# EasyEDA Pro project ProProject_Stc32f_Car副本_2024-06-03.epro, board PCB6
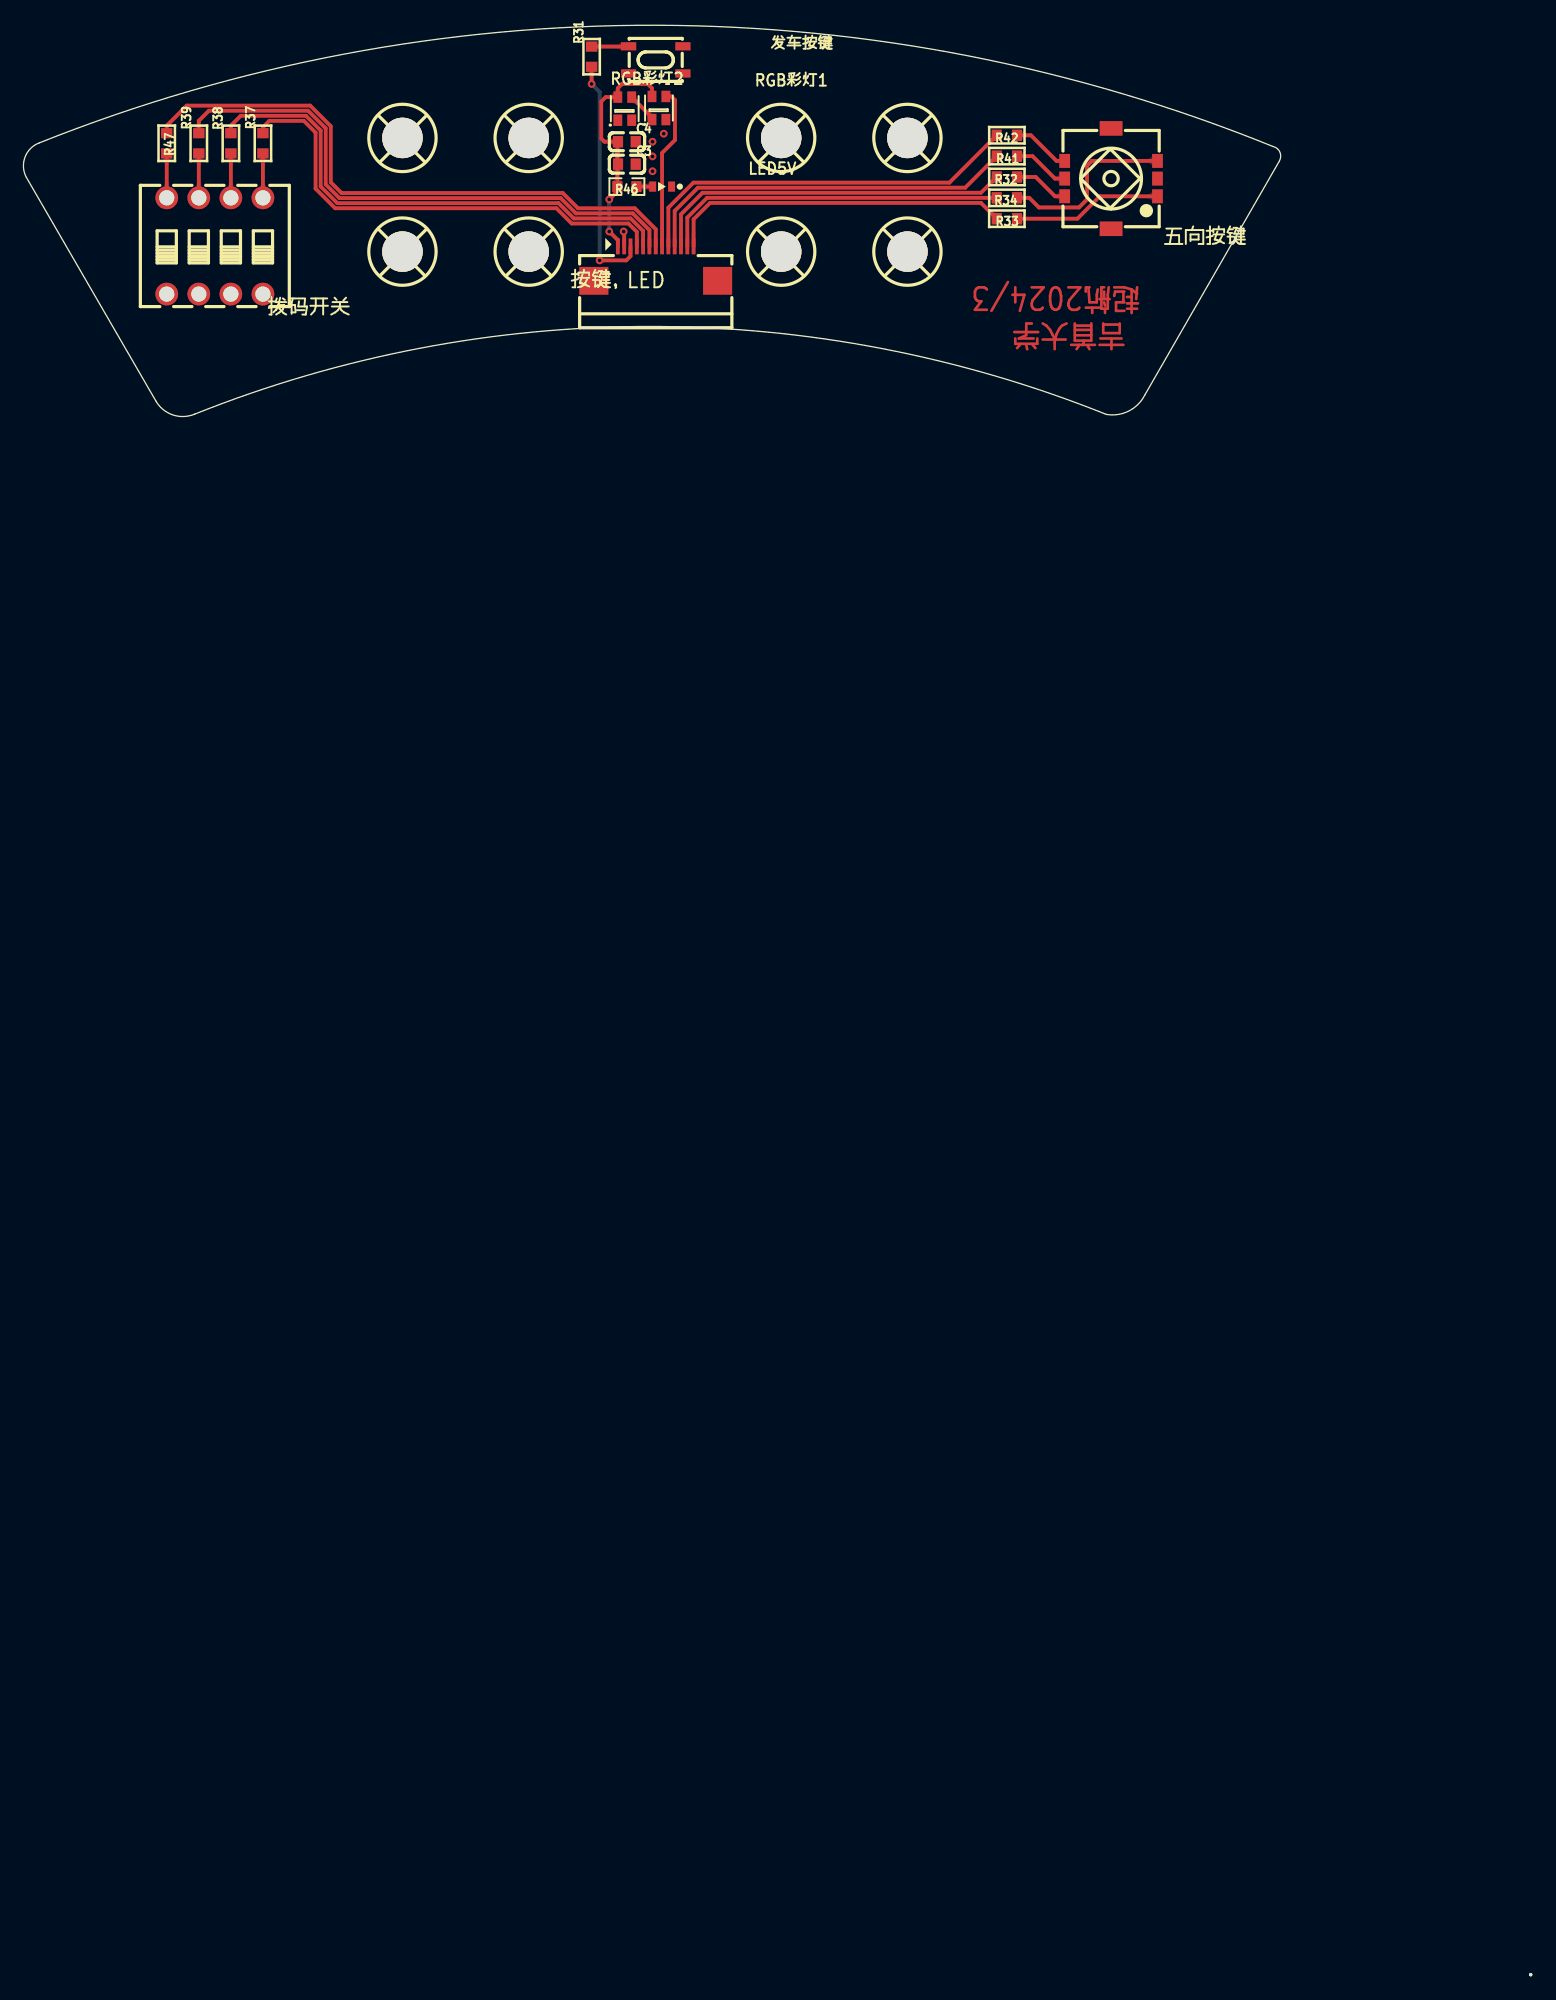
[diagram p11: board, top side]
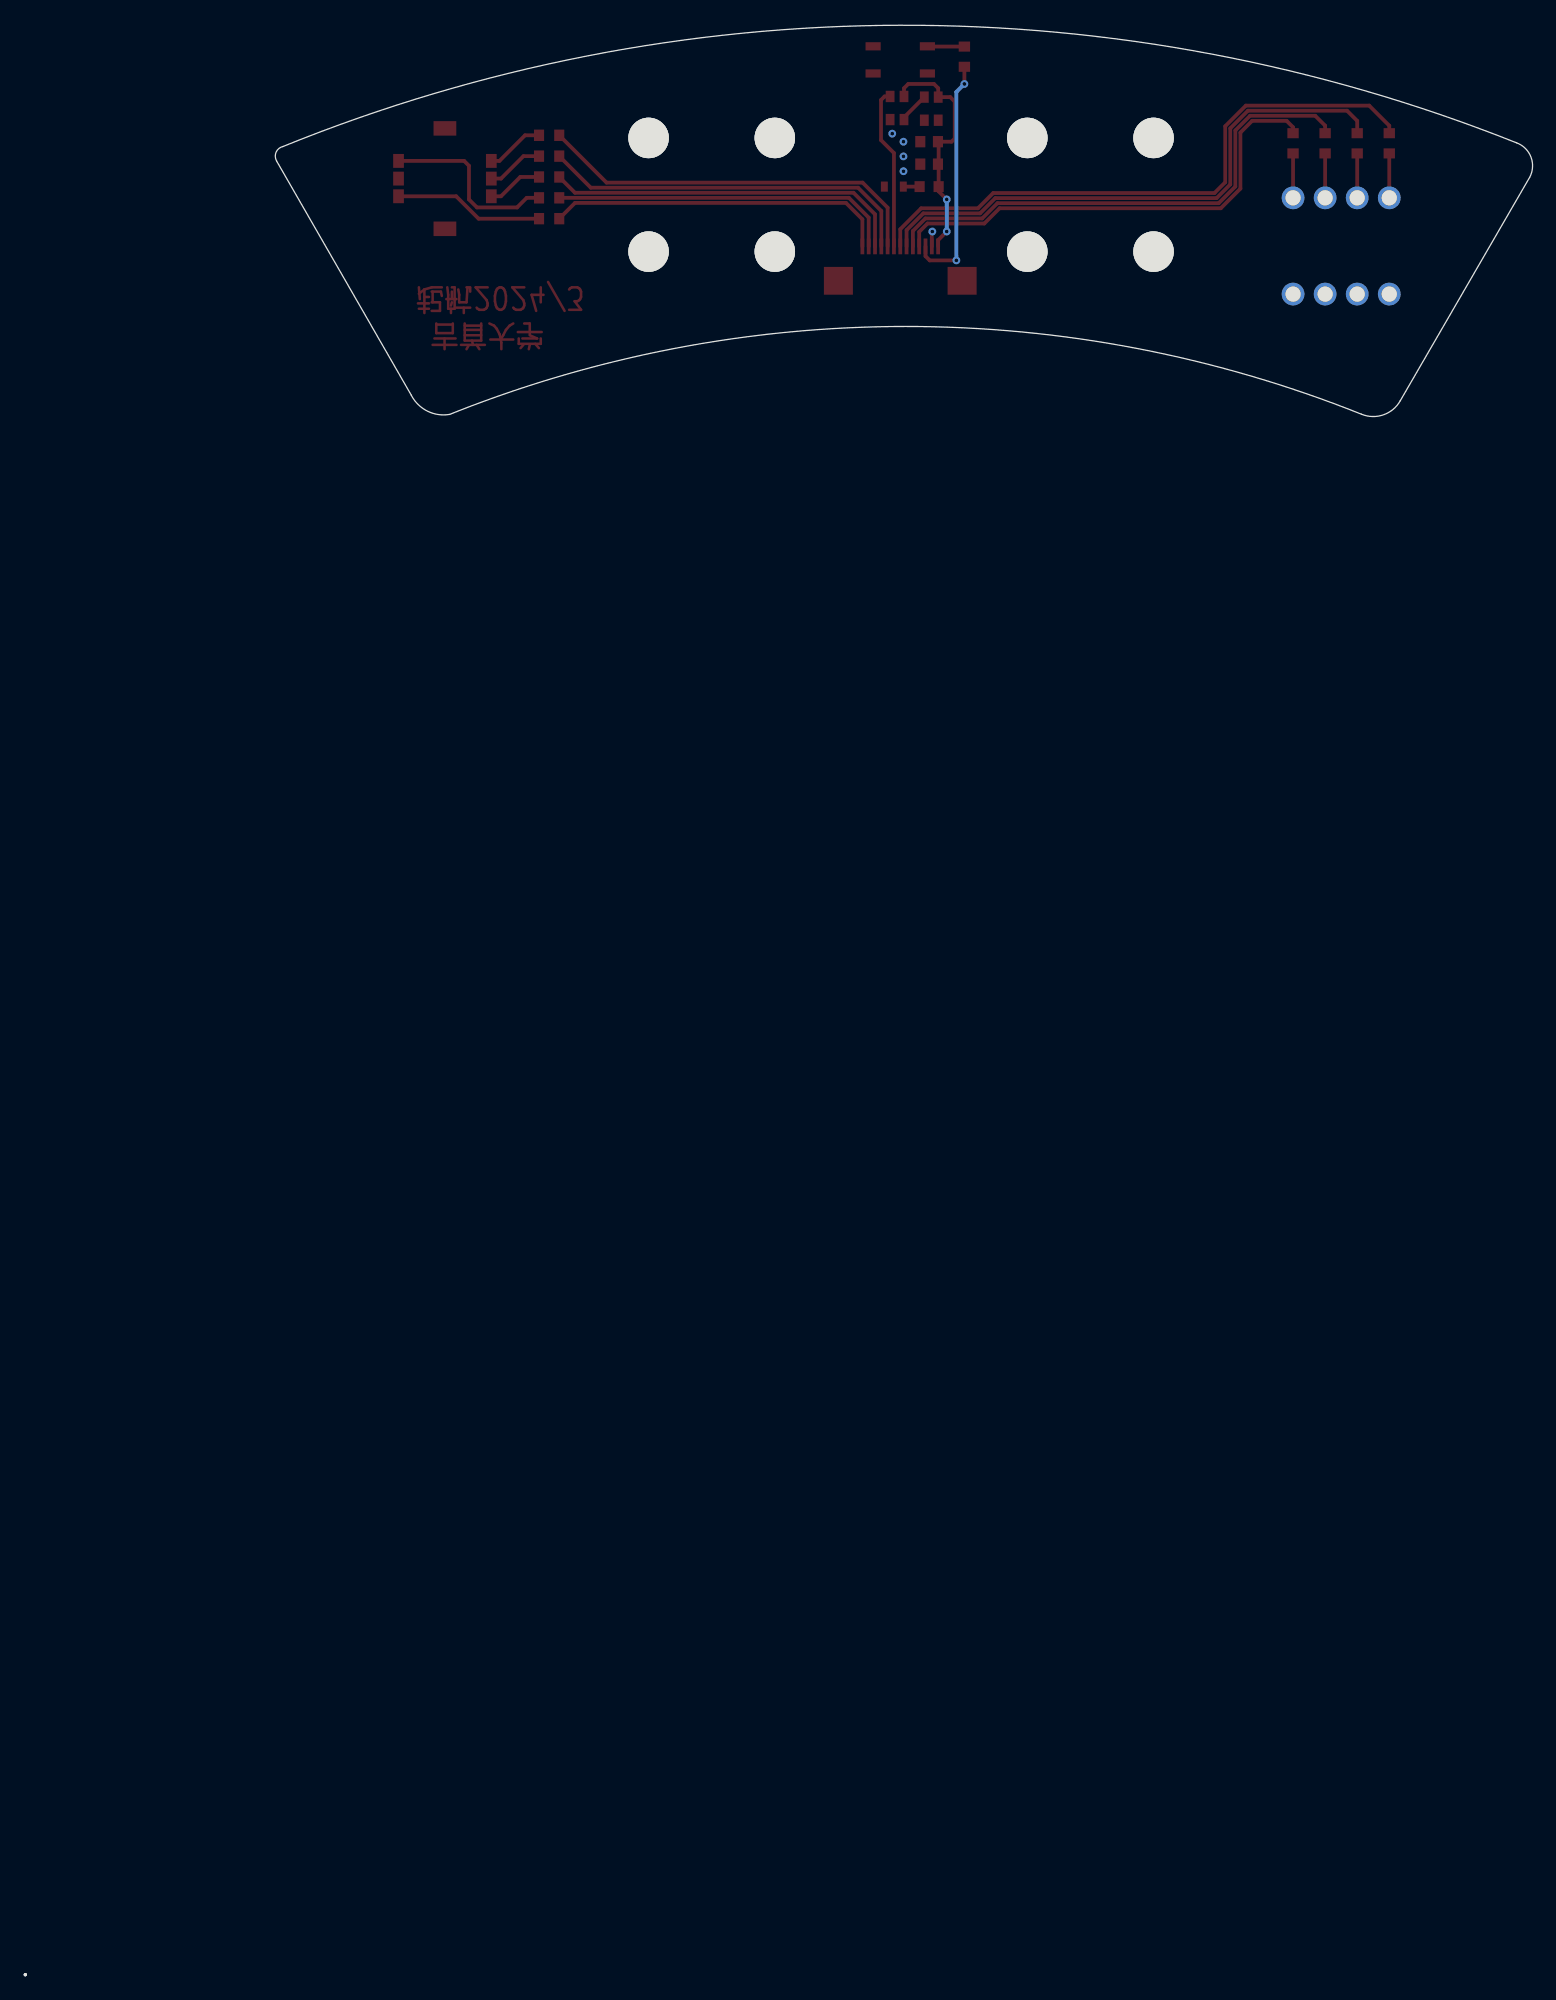
[diagram p12: board, bottom side, seen from below]

Outline 119.4 x 154.35 mm; copper layers: Top Layer, Bottom Layer. Coordinates in mm from the lower left corner of the outline.
Outline path: 0.23,142.3 arc(0.14,143.96) 1.27,145.05 arc(50.11,154.35) 98.98,144.75 arc(99.53,144.31) 99.49,143.61 88.82,125.07 arc(87.55,123.8) 85.77,123.54 arc(49.64,130.5) 13.56,123.56 arc(11.85,123.49) 10.49,124.61 0.23,142.3 ; 119.39,0.01 arc(119.39,0) 119.4,0 119.39,0.01 119.39,0.01
Stack: Top Layer 0.035mm / Dielectric1 1.51mm FR4 er 4.5 / Bottom Layer 0.035mm

## Design rules (mm)
template: 自定义配置
spacing copperThickness1oz (default): track to track 0.102, other pairs 0.152 to 0.3
spacing copperThickness2oz: track to track 0.203, other pairs 0.152 to 0.3
track width copperThickness1oz (default): min 0.127, default 0.254, max 2.54
track width copperThickness2oz: min 0.203, default 0.254, max 2.54
differential pair differentialPair (default): width min 0.127, default 0.254, max 2.54; gap min 0.152, default 0.152
via viaSize (default): diameter min 0.5, default 0.61, max 10; hole min 0.3, default 0.305, max 6.299

## Placement (name value [footprint] x y rotation side)
C3  100nF  [C0603]  47.8 143.35 180 top
C4  100nF  [C0603]  47.8 145.13 180 top
LED5V  翠绿贴片LED  [LEDC1608(0603)-L]  50.59 141.58 180 top
R31  100R  [RESC1608[0603]S-N]  45.01 151.86 90 top
R32  100R  [RESC1608[0603]S-N]  77.9 142.34 180 top
R33  100R  [RESC1608[0603]S-N]  77.9 139.04 0 top
R34  100R  [RESC1608[0603]S-N]  77.9 140.69 180 top
R37  100R  [RESC1608[0603]S-N]  18.97 145 270 top
R38  100R  [RESC1608[0603]S-N]  16.43 145 270 top
R39  100R  [RESC1608[0603]S-N]  13.89 145 270 top
R41  100R  [RESC1608[0603]S-N]  77.9 143.99 180 top
R42  100R  [RESC1608[0603]S-N]  77.9 145.64 180 top
R46  4.7K  [R0603]  47.8 141.58 180 top
R47  100R  [RESC1608[0603]S-N]  11.35 145 270 top
RGB彩灯1  WS2812C-2020-V1  [LED-SMD_4P-L2.0-W2.0-TL_WS2812B-2020]  50.34 147.8 90 top
RGB彩灯2  WS2812C-2020-V1  [LED-SMD_4P-L2.0-W2.0-TL_WS2812B-2020]  47.63 147.75 90 top
SCREW1  -  [M3螺丝]  30.09 145.37 0 top
SCREW1#2  -  [M3螺丝]  40.09 145.37 0 top
SCREW1#3  -  [M3螺丝]  30.09 136.37 0 top
SCREW1#4  -  [M3螺丝]  40.09 136.37 0 top
SCREW1#5  -  [M3螺丝]  60.09 145.37 0 top
SCREW1#6  -  [M3螺丝]  70.09 145.37 0 top
SCREW1#7  -  [M3螺丝]  60.09 136.37 0 top
SCREW1#8  -  [M3螺丝]  70.09 136.37 0 top
五向按键  五向按键  [SW-SMD_GT-TC0060-H050-L1]  86.15 142.21 180 top
发车按键  TS3425PA 250gf 098  [SW-SMD_4P-L4.2-W3.4-P2.15-LS5.2]  50.09 151.61 0 top
拨码开关  DSWB04LHGET  [SW-TH_DSWB04LHGET]  15.16 136.88 0 top
按键，LED  按键，LED  [FPC-SMD_13P-P0.50_AFD01-S13FCA--00]  50.09 135.48 180 top

## Footprints (pads in the part's own frame, mm; a bottom-side part is the same pattern mirrored in y, then rotated)
C0603
  rect 0.8x0.9 smd: 1(-0.7,0) 2(0.7,0)
FPC-SMD_13P-P0.50_AFD01-S13FCA--00
  rect 0.3x1.25 smd: 1(3,-1.363) 2(2.5,-1.363) 3(2,-1.363) 4(1.5,-1.363) 5(1,-1.363) 6(0.5,-1.363) 7(0,-1.363) 8(-0.5,-1.363) 9(-1,-1.363) 10(-1.5,-1.363) 11(-2,-1.363) 12(-2.5,-1.363) 13(-3,-1.363)
  rect 2.3x2.2 smd: 14(-4.9,1.363) 15(4.9,1.363)
LED-SMD_4P-L2.0-W2.0-TL_WS2812B-2020
  rect 0.9x0.7 smd: 1(-0.915,0.55) 2(-0.915,-0.55) 3(0.915,-0.55) 4(0.915,0.55)
LEDC1608(0603)-L
  rect 0.55x0.8 smd: A(0.75,0) C(-0.75,0)
M3螺丝
  round 3.2 hole 3.2: 1(-0.064,0.064)
R0603
  rect 0.806x0.864 smd: 1(-0.753,0) 2(0.753,0)
RESC1608[0603]S-N
  rect 0.8x0.9 smd: 1(-0.8,0) 2(0.8,0)
SW-SMD_4P-L4.2-W3.4-P2.15-LS5.2
  rect 1.2x0.65 smd: 1(-2.15,1.075) 2(2.15,1.075) 3(-2.15,-1.075) 4(2.15,-1.075)
SW-SMD_GT-TC0060-H050-L1
  rect 0.85x1.1 smd: 1(-3.675,1.4) 2(-3.675,0) 3(-3.675,-1.4) 4(3.675,1.4) 5(3.675,0) 6(3.675,-1.4)
  rect 1.8x1.15 smd: 7(0,3.975) 8(0,-3.975)
SW-TH_DSWB04LHGET
  round 1.8 hole 1.2: 1(-3.81,3.81) 2(-1.27,3.81) 3(1.27,3.81) 4(3.81,3.81) 5(-3.81,-3.81) 6(-1.27,-3.81) 7(1.27,-3.81) 8(3.81,-3.81)

## Nets
GND: C3.1 C4.1 LED5V.C RGB彩灯1.2 RGB彩灯2.2 五向按键.2 发车按键.4 拨码开关.5 拨码开关.6 拨码开关.7 拨码开关.8 按键，LED.2
VCC5V: C3.2 C4.2 R46.2 RGB彩灯1.4 RGB彩灯2.4 按键，LED.1
0.6: R37.1 按键，LED.4
1.1: R38.1 按键，LED.5
1.5: R39.1 按键，LED.6
1.6: R47.1 按键，LED.7
1.7: RGB彩灯1.3 按键，LED.8
3.6: R41.2 按键，LED.10
3.7: R32.2 按键，LED.11
4.4: R42.2 按键，LED.9
5.0: R34.2 按键，LED.12
5.1: R33.1 按键，LED.13
5.2: R31.1 按键，LED.3
$1N753: R41.1 五向按键.5
$1N754: R42.1 五向按键.6
$1N755: R32.1 五向按键.4
$1N767: R33.2 五向按键.1
$1N768: R34.1 五向按键.3
$1N1432: R37.2 拨码开关.4
$1N1433: R38.2 拨码开关.3
$1N1435: R39.2 拨码开关.2
$1N3416: R31.2 发车按键.1
$1N3923: LED5V.A R46.1
$1N8810: R47.2 拨码开关.1
$1N9803: RGB彩灯1.1 RGB彩灯2.3

Pads without a net: RGB彩灯2 1; SCREW1 1; SCREW1#2 1; SCREW1#3 1; SCREW1#4 1; SCREW1#5 1; SCREW1#6 1; SCREW1#7 1; SCREW1#8 1; 五向按键 7 8; 发车按键 2 3; 按键，LED 14 15

## Via types
v1: diameter 0.61, hole 0.305, Top Layer to Bottom Layer, 9 vias

## Routing (per net, layer and track width the routed paths; a pad name or vN(x,y) marks a point on that pad's centre or on a via; arc(x,y) is an arc through that point)
GND: length 1.2
  Top Layer w0.3: v1(47.54,138.02) 47.58,137.98 按键，LED.2
  vias: v1(49.83,145.13) v1(49.83,143.97) v1(49.83,142.79) v1(50.72,145.77)
VCC5V: length 18.9
  Top Layer w0.3: v1(46.4,140.56) 47.04,141.2 R46.2 47.04,145.08 ; 按键，LED.1 47.08,137.34 v1(46.4,138.02) ; C4.2 46.02,145.13 45.76,145.39 45.76,148.31 46.12,148.66 RGB彩灯2.4 47.08,149.36 47.42,149.7 49.45,149.7 49.79,149.36 RGB彩灯1.4
  Bottom Layer w0.3: v1(46.4,138.02) v1(46.4,140.56)
0.6: length 37.7
  Top Layer w0.3: 18.97,145.81 18.97,146.27 19.48,146.78 22.21,146.78 23.14,145.85 23.14,141.42 24.69,139.86 42.22,139.86 43.43,138.66 47.93,138.66 48.59,138 按键，LED.4
1.1: length 41.2
  Top Layer w0.3: 16.43,145.81 16.43,146.4 17.21,147.18 22.38,147.18 23.54,146.02 23.54,141.58 24.86,140.27 42.38,140.27 43.59,139.06 48.09,139.06 49.08,138.06 按键，LED.5
1.5: length 44.8
  Top Layer w0.3: 按键，LED.6 49.59,138.13 48.26,139.46 43.76,139.46 42.55,140.67 25.03,140.67 23.95,141.75 23.95,146.19 22.55,147.59 14.69,147.59 13.89,146.78 13.89,145.81
1.6: length 48
  Top Layer w0.3: 11.35,145.81 11.35,146.4 12.93,147.99 22.71,147.99 24.34,146.35 24.34,141.92 25.19,141.07 42.72,141.07 43.93,139.86 48.42,139.86 50.08,138.2 按键，LED.7
1.7: length 12.9
  Top Layer w0.3: 按键，LED.8 50.58,144.23 51.61,145.26 51.61,148.43 51.33,148.71 RGB彩灯1.3
3.6: length 30.1
  Top Layer w0.3: 按键，LED.10 51.58,139.65 53.43,141.49 74.6,141.49 R41.2
3.7: length 28.8
  Top Layer w0.3: R32.2 75.85,141.09 53.79,141.09 52.09,139.38 按键，LED.11
4.4: length 31.5
  Top Layer w0.3: R42.2 73.35,141.89 53.07,141.89 51.09,139.91 按键，LED.9
5.0: length 27.4
  Top Layer w0.3: R34.2 54.15,140.69 52.59,139.12 按键，LED.12
5.1: length 27.2
  Top Layer w0.3: R33.1 75.85,140.29 54.38,140.29 53.09,138.99 按键，LED.13
5.2: length 19
  Top Layer w0.3: v1(45.64,135.73) 47.75,135.73 48.08,136.07 按键，LED.3 ; R31.1 v1(45,149.7)
  Bottom Layer w0.3: v1(45,149.7) 45.64,149.07 v1(45.64,135.73)
$1N753: length 4.5
  Top Layer w0.3: 五向按键.5 81.71,142.21 79.93,143.99 R41.1
$1N754: length 4.6
  Top Layer w0.3: 五向按键.6 81.83,143.61 79.8,145.64 R42.1
$1N755: length 4.4
  Top Layer w0.3: R32.1 80.18,142.34 81.71,140.81 五向按键.4
$1N767: length 11.9
  Top Layer w0.3: 五向按键.1 85.26,140.81 83.48,139.04 R33.2
$1N768: length 14.5
  Top Layer w0.3: 五向按键.3 84.63,143.61 84.25,143.23 84.25,140.56 83.61,139.92 80.44,139.92 79.68,140.69 R34.1
$1N1432: length 3.5
  Top Layer w0.3: 拨码开关.4 R37.2
$1N1433: length 3.5
  Top Layer w0.3: 拨码开关.3 R38.2
$1N1435: length 3.5
  Top Layer w0.3: 拨码开关.2 R39.2
$1N3416: length 2.9
  Top Layer w0.3: 45.01,152.66 47.92,152.66 发车按键.1
$1N3923: length 1.3
  Top Layer w0.3: LED5V.A R46.1
$1N8810: length 3.5
  Top Layer w0.3: 拨码开关.1 R47.2
$1N9803: length 2.4
  Top Layer w0.3: RGB彩灯1.1 49.79,147.05 RGB彩灯2.3

## Copper pours and planes (outline as drawn; the poured copper is in the pictures)
GND on Top Layer: -1.86,155.29 100.76,155.29 100.76,118.08 -1.86,118.08
GND on Bottom Layer: -9.35,161.01 108,161.01 108,112.24 -9.35,112.24
VCC5V on Top Layer: 49.2,148.18 50.29,148.18 50.29,150.04 45.57,150.04 45.57,140.18 47.67,140.18 47.67,145.96 47.67,145.97 46.56,145.97 46.56,148.15 46.57,148.16 47.58,148.16 47.58,149.41 47.62,149.45 49.2,149.45

Small or netless copper shapes (teardrops, artwork), in the pictures only: 57 on Top Layer, 4 on Bottom Layer

## Text on the board
Top Layer: 吉首大学 / 起航2024/3
